# EAGLE design O2_PROM_ISP_FFC_R_A00 (EAGLE 9.6.2)
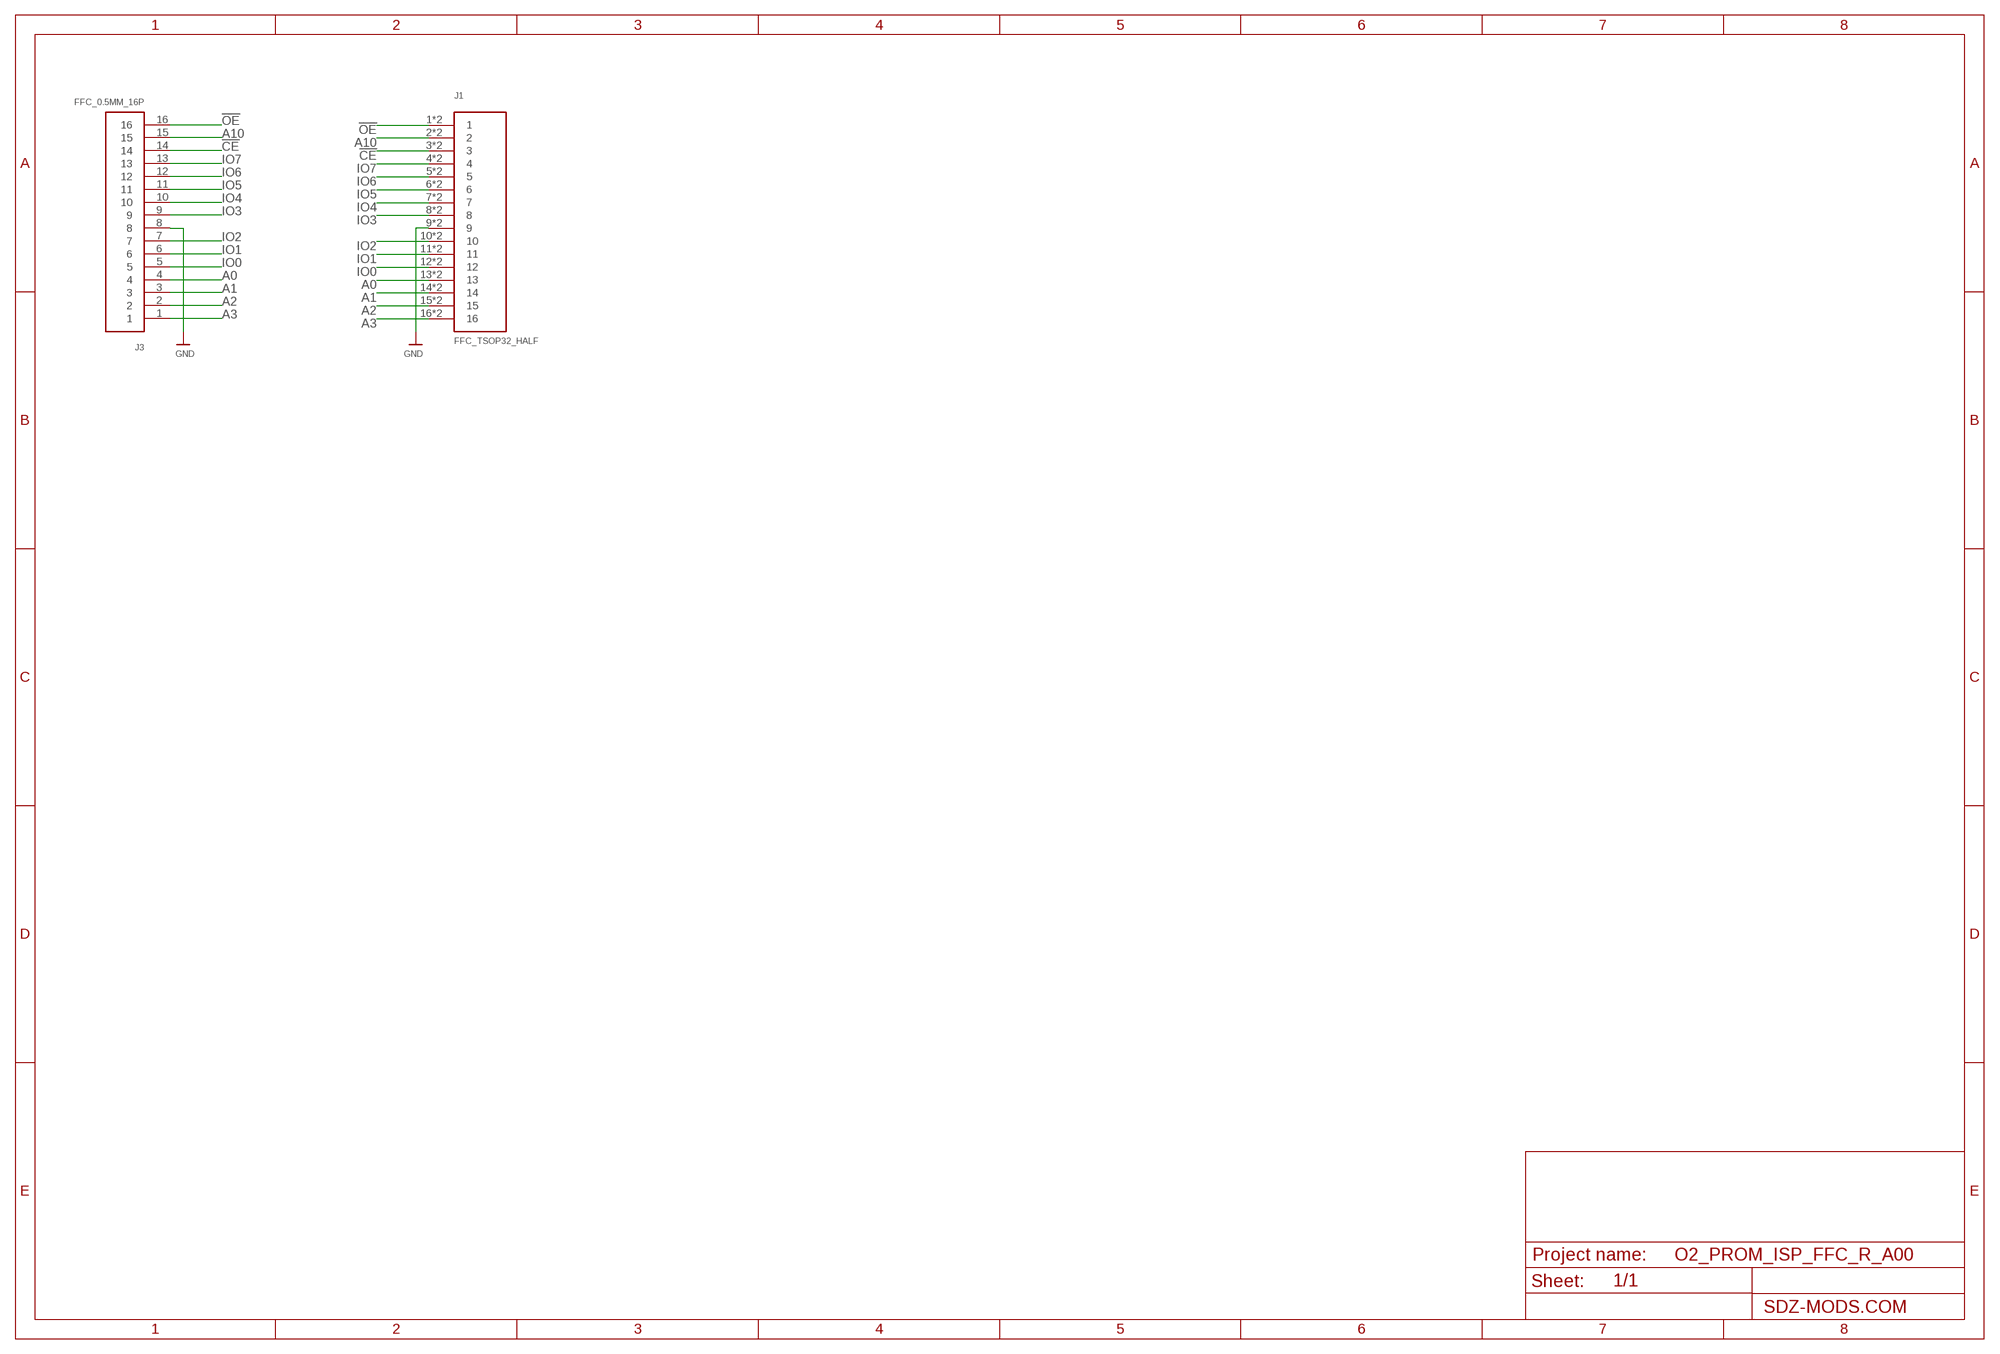
[diagram p0: schematic, sheet 1]

## Parts
J1  FFC_TSOP32_HALF  [FFC_TSOP32_HALF]
J3  FFC_0.5MM_16P  [FFC_0.5MM_16P]

## Nets
!CE: J1.3 J1.3A J3.14
!OE: J1.1 J1.1A J3.16
A0: J1.13 J1.13A J3.4
A1: J1.14 J1.14A J3.3
A2: J1.15 J1.15A J3.2
A3: J1.16 J1.16A J3.1
A10: J1.2 J1.2A J3.15
GND: J1.9 J1.9A J3.8
IO0: J1.12 J1.12A J3.5
IO1: J1.11 J1.11A J3.6
IO2: J1.10 J1.10A J3.7
IO3: J1.8 J1.8A J3.9
IO4: J1.7 J1.7A J3.10
IO5: J1.6 J1.6A J3.11
IO6: J1.5 J1.5A J3.12
IO7: J1.4 J1.4A J3.13

## Library data of the parts
J1 = FFC_TSOP32_HALF:FFC_TSOP32_HALF
J3 = FFC_05MM_16P:FFC_0.5MM_16P

## Board
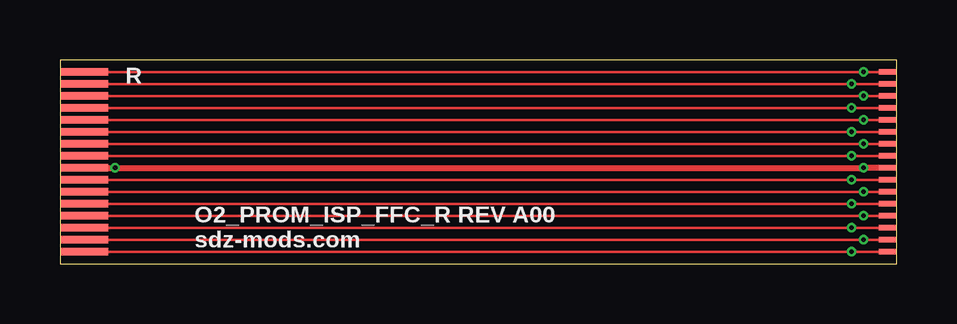
[diagram p1: board, top side]
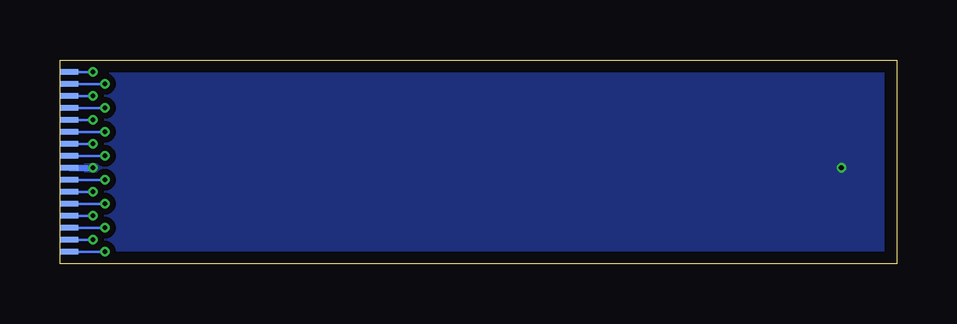
[diagram p2: board, bottom side, seen from below]

Size 34.88 x 8.5 mm. Coordinates in mm from the lower left corner, seen from the top.
Outline: 0,0 34.88,0 34.88,8.5 0,8.5 0,0
Copper layers (1*16): Top 0.035mm / dielectric 1.5mm / Bottom 0.035mm
Design rules "default *": minimum track width 0.1mm, minimum drill 0.15mm, track to track 0.1mm, track to pad 0.1mm, pad to pad 0.1mm, via to via 0.1mm, smd to smd 0.1mm, copper to edge 20mil, drill to drill 6mil, minimum pad ring 10mil, minimum via ring 0.1mm, stop-mask expansion 4mil, vias tented up to drill 0.35mm, thermal gap 10mil

### Footprints (pad centres in the part's own frame; a part is rotated, then mirrored left to right if it is on the bottom)
FFC_TSOP32_HALF = smd 0.75 x 0.22: 1 0,3.75; 2 0,3.25; 3 0,2.75; 4 0,2.25; 5 0,1.75; 6 0,1.25; 7 0,0.75; 8 0,0.25; 9 0,-0.25; 10 0,-0.75; 11 0,-1.25; 12 0,-1.75; 13 0,-2.25; 14 0,-2.75; 15 0,-3.25; 16 0,-3.75 | smd 0.75 x 0.22 bottom: 1A 0,3.75; 2A 0,3.25; 3A 0,2.75; 4A 0,2.25; 5A 0,1.75; 6A 0,1.25; 7A 0,0.75; 8A 0,0.25; 9A 0,-0.25; 10A 0,-0.75; 11A 0,-1.25; 12A 0,-1.75; 13A 0,-2.25; 14A 0,-2.75; 15A 0,-3.25; 16A 0,-3.75
FFC_0.5MM_16P = smd 2 x 0.3: 1 0,-3.75; 2 0,-3.25; 3 0,-2.75; 4 0,-2.25; 5 0,-1.75; 6 0,-1.25; 7 0,-0.75; 8 0,-0.25; 9 0,0.25; 10 0,0.75; 11 0,1.25; 12 0,1.75; 13 0,2.25; 14 0,2.75; 15 0,3.25; 16 0,3.75

### Placement (x,y rotation side)
J1  34.5,4.25 0 top
J3  1,4.25 0 top

### Tracks (layer width: path | path; a pad name or v marks a point on that pad's centre or on a via)
!CE  (via drill 0.2)
  Top 0.1: J1.3 v33.5,7 J3.14
  Bottom 0.1: J1.3 v33.5,7
!OE  (via drill 0.2)
  Top 0.1: J3.16 v33.5,8 J1.1A
  Bottom 0.1: J1.1A v33.5,8
A0  (via drill 0.2)
  Top 0.1: J1.13 v33.5,2 J3.4
  Bottom 0.1: J1.13 v33.5,2
A1  (via drill 0.2)
  Top 0.1: J1.14A v33,1.5 J3.3
  Bottom 0.1: J1.14A v33,1.5
A2  (via drill 0.2)
  Top 0.1: J1.15 v33.5,1 J3.2
  Bottom 0.1: J1.15 v33.5,1
A3  (via drill 0.2)
  Top 0.1: J1.16A v33,0.5 J3.1
  Bottom 0.1: J1.16A v33,0.5
A10  (via drill 0.2)
  Top 0.1: J3.15 v33,7.5 | v33,7.5 34.32,7.5 | J1.2A v33,7.5
  Bottom 0.1: J1.2A v33,7.5
GND  (via drill 0.2)
  Top 0.254: J3.8 v2.3,4 v33.5,4 J1.9
  Bottom 0.254: J1.9 v33.5,4
  pour Bottom (isolate 0.25): -0.25,8.9 35.62,8.9 35.62,-0.4 -0.25,-0.4
IO0  (via drill 0.2)
  Top 0.1: J1.12 v33,2.5 J3.5
  Bottom 0.1: J1.12 v33,2.5
IO1  (via drill 0.2)
  Top 0.1: J1.11 v33.5,3 J3.6
  Bottom 0.1: J1.11 v33.5,3
IO2  (via drill 0.2)
  Top 0.1: J1.10A v33,3.5 J3.7
  Bottom 0.1: J1.10A v33,3.5
IO3  (via drill 0.2)
  Top 0.1: J1.8 v33,4.5 J3.9
  Bottom 0.1: J1.8 v33,4.5
IO4  (via drill 0.2)
  Top 0.1: J1.7A v33.5,5 J3.10
  Bottom 0.1: J1.7A v33.5,5
IO5  (via drill 0.2)
  Top 0.1: J1.6 v33,5.5 J3.11
  Bottom 0.1: J1.6 v33,5.5
IO6  (via drill 0.2)
  Top 0.1: J1.5 v33.5,6 J3.12
  Bottom 0.1: J1.5 v33.5,6
IO7  (via drill 0.2)
  Top 0.1: J1.4 v33,6.5 J3.13
  Bottom 0.1: J1.4 v33,6.5

### Text on the board
tPlace: R | O2_PROM_ISP_FFC_R REV A00 / sdz-mods.com
stiffener: 4x8.5mm stiffener / Stiffener material: polyimide / Stiffener thickness: 0.2mm / Final thickness: 0.29-0.34mm